# Altium schematic sheet vccs_pullup.SchDoc
size A; SheetNumber: 4; SheetTotal: 9
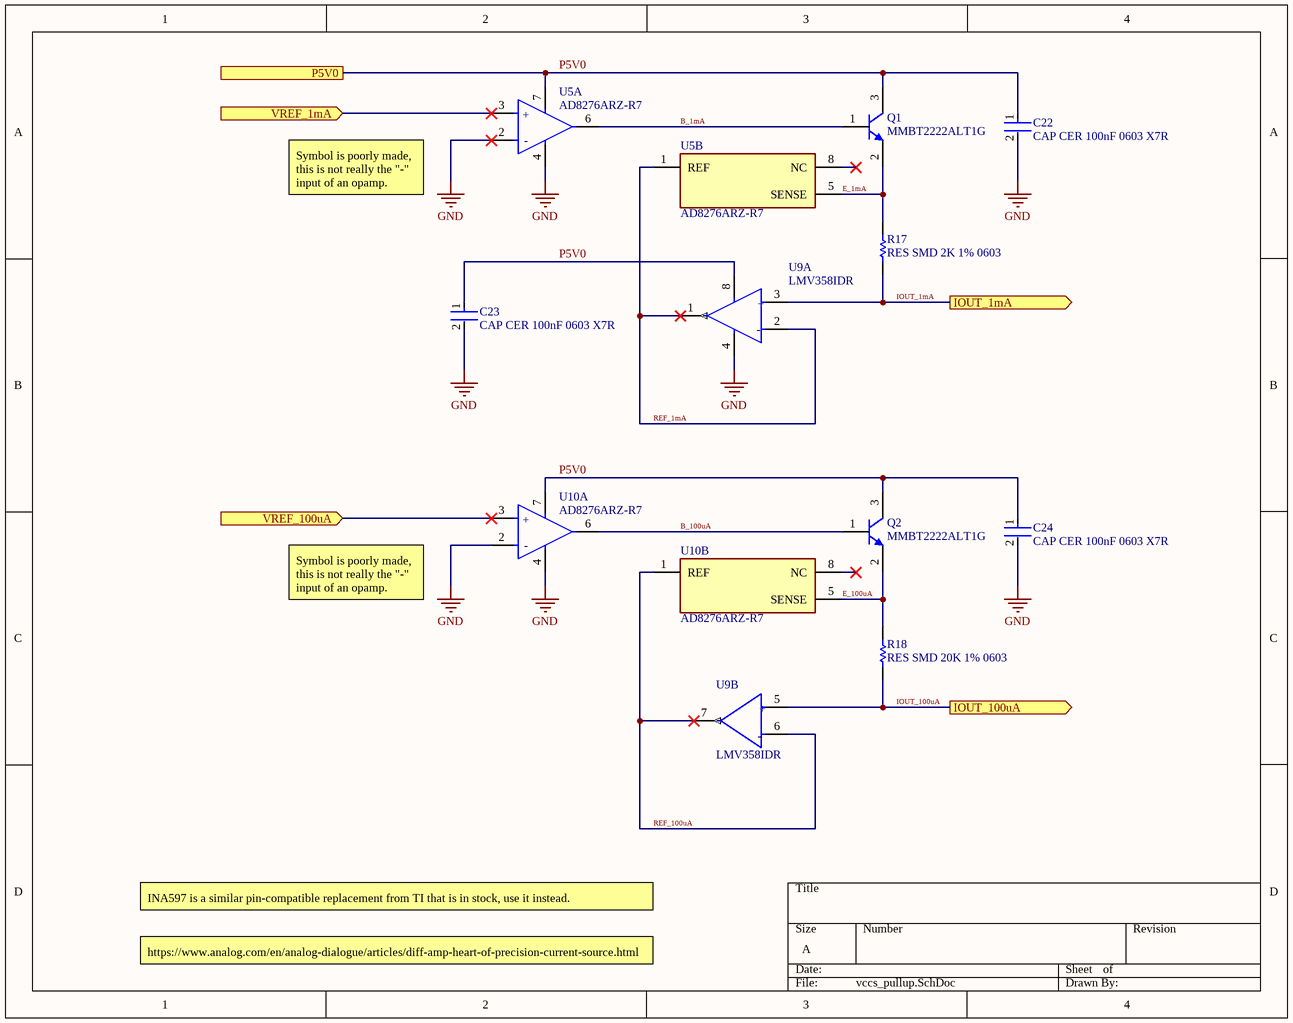
[diagram p0: vccs_pullup.SchDoc]

## Parts
C22  CAP CER 100nF 0603 X7R  [FP-CC0603-DA-MFG]
C23  CAP CER 100nF 0603 X7R  [FP-CC0603-DA-MFG]
C24  CAP CER 100nF 0603 X7R  [FP-CC0603-DA-MFG]
Q1  MMBT2222ALT1G  [ONSC-SOT-23-3-318-08_V]
Q2  MMBT2222ALT1G  [ONSC-SOT-23-3-318-08_V]
R17  RES SMD 2K 1% 0603  [RESC1609X50X30LL10T20]
R18  RES SMD 20K 1% 0603  [RESC1609X50X30LL10T20]
U5  AD8276ARZ-R7  [FP-R-8-IPC_C]  (parts A,B of 2)
U9  LMV358IDR  [FP-D0008A-MFG]  (parts A,B of 2)
U10  AD8276ARZ-R7  [FP-R-8-IPC_C]  (parts A,B of 2)

## Ports
IOUT_1mA (out), IOUT_100uA (out), P5V0, VREF_1mA (in), VREF_100uA (in)

## Nets
GND: C22.2 C23.2 C24.2 U5.2(-IN) U5.4(-VS) U9.4(GND) U10.2(-IN) U10.4(-VS)
B_1mA: Q1.1(B) U5.6(OUT)
B_100uA: Q2.1(B) U10.6(OUT)
E_1mA: Q1.2(E) R17.2 U5.5(SENSE)
E_100uA: Q2.2(E) R18.2 U10.5(SENSE)
IOUT_1mA: R17.1 U9.3(1IN+) ; port IOUT_1mA
IOUT_100uA: R18.1 U9.5(2IN+) ; port IOUT_100uA
P5V0: C22.1 C23.1 C24.1 Q1.3(C) Q2.3(C) U5.7(+VS) U9.8(VCC+) U10.7(+VS) ; port P5V0
REF_1mA: U5.1(REF) U9.1(OUT) U9.2(1IN-)
REF_100uA: U9.6(2IN-) U9.7(2OUT) U10.1(REF)
VREF_1mA: U5.3(+IN) ; port VREF_1mA
VREF_100uA: U10.3(+IN) ; port VREF_100uA

Not connected (* = marked no-connect by the designer): U5 8(NC)*; U10 8(NC)*

## Notes on the sheet
- Symbol is poorly made,
  this is not really the "-"
  input of an opamp.
- INA597 is a similar pin-compatible replacement from TI that is in stock, use it instead.
- https://www.analog.com/en/analog-dialogue/articles/diff-amp-heart-of-precision-current-source.html
- (in symbol CMP-04895-000136-1, part A) +; -
- (in symbol CMP-04895-000136-1, part B) +; -
- (in symbol CMP-09116-000144-1, part A) +

## Library data of the parts
C22-C24 = CMP-03422-000030-1: CAP CER 0.1UF 16V X7R 0603; Manufacturer Part Number: CC0603KRX7R7BB104; Manufacturer: YAGEO; Tolerance: 0.1; Temperature Coefficient: 15%; Material: Ceramic; Voltage Rating: 16 V; Package: CC0603-DA; ComponentLink2Description: Datasheet; Octopart: https://octopart.com/cc0603krx7r7bb104-yageo-192941; Temperature Range High: +125°C; Digikey Description: CAP CER 0.1UF 16V X7R 0603; Value: 100 nF; Voltage: 16 V; Device Class L2: Capacitors; Height: 0.9mm; Temperature: -55°C to +125°C; Device Class L1: Passive Components; Device Class L3: Ceramic Capacitors; ComponentLink2URL: http://www.yageo.com/documents/recent/UPY-GPHC_X7R_6.3V-to-50V_18.pdf; Footprint Url: http://www.yageo.com/exep/pages/download/literatures/UPY-C_GEN_24.pdf; RoHS: TRUE; Temperature Range Low: -55°C; Temperature Characteristic: X7R; Lead Free: Yes; Capacitance: 100 nF; Category: Cap; Mouser Description: Multilayer Ceramic Capacitor, CC Series, 0.1 - F, - 10%, X7R, 16 V, 0603 [1608 Metric]; Automotive: No
Q1 Q2 = CMP-1048-00538-1: General Purpose Transistor, NPN Silicon, 3-Pin SOT-23, Pb-Free, Tape and Reel; Manufacturer: On Semiconductor; fT Min (MHz): 300; IC Continuous (A): 0.6; ComponentLink3URL: http://www.onsemi.cn/pub_link/Collateral/318-08.PDF; PartNumber: MMBT2222ALT1G; RoHS: TRUE; ComponentLink1URL: http://www.onsemi.com/; ComponentLink3Description: Package Specification; ComponentLink2Description: Datasheet; Mounting Technology: Surface Mount; Packing: Tape and Reel; PackageDescription: 3-Pin Small Outline Transistor, Body 2.92 x 1.3 mm, Pitch 0.95 mm; DatasheetVersion: Rev. 10; PackageReference: SOT-23-3-318-08; ComponentLink2URL: http://www.onsemi.cn/pub_link/Collateral/MMBT2222LT1-D.PDF; Polarity: NPN; PackageVersion: Rev. AP, 11/2009; ComponentLink1Description: Manufacturer URL
R17 R18 = CMP-2000-03820-1: DNP; Part Number: CRCW0603100KFKEA; Manufacturer: Vishay Dale
U5 U10 = CMP-09116-000144-1: IC OPAMP DIFF 1 CIRCUIT 8SOIC; Number of Elements: 1; Max Dual Supply Voltage: 18V; Slew Rate: 1.1V/µs; Max Supply Voltage: 36V; Output Current per Channel: 15mA; Common Mode Rejection Ratio: 86dB; Amplifier Type: DIFFERENTIAL; Input Resistance: 80kR; Operating Supply Current: 200uA; Min Dual Supply Voltage: 2V; Input Offset Voltage (Vos): 200uV; Gain Bandwidth Product: 550kHz; Max Operating Temperature: 125°C; RoHS Compliant: Yes; Package Quantity: 1000; Number of Pins: 8; Mount: Surface Mount; Min Operating Temperature: -40°C; Number of Channels: 1; Contact Plating: Tin; Case/Package: SOIC; Lead Free: Contains Lead; Weight: 0.019048oz; Number of Circuits: 1; Packaging: Tape and Reel; Series: -; Min Supply Voltage: 2V
U9 = CMP-04895-000136-1: IC OPAMP GP 2 CIRCUIT 8SOIC; Number of Elements: 2; Min Supply Voltage: 2.7V; Input Bias Current: 250nA; Output Current per Channel: 160mA; Bandwidth: 1MHz; Voltage Gain: 100dB; Input Offset Voltage (Vos): 7mV; Slew Rate: 1V/µs; Nominal Supply Current: 440uA; Power Supply Rejection Ratio (PSRR): 50dB; Max Supply Voltage: 5.5V; Operating Supply Current: 210uA; Lead Free: Lead Free; Length: 4.9mm; RoHS Compliant: Yes; REACH SVHC: No SVHC; Case/Package: SOIC; Height: 1.58mm; Number of Channels: 2; Number of Amplifiers: 2; Radiation Hardening: No; Number of Circuits: 2; Mount: Surface Mount; Contact Plating: Gold; Unity Gain Bandwidth Product: 1MHz; Min Operating Temperature: -40°C; Max Operating Temperature: 125°C; Width: 3.91mm; Gain Bandwidth Product: 1MHz; Number of Pins: 8; Packaging: Tape and Reel; Package Quantity: 2500; Output Current: 160mA; Common Mode Rejection Ratio: 50dB